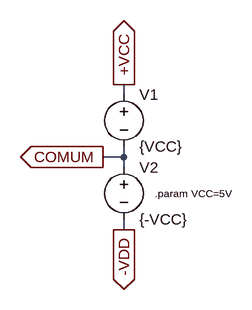
[diagram p0: schematic _SimetricSource.asc]
_SimetricSource.asc, the LTspice schematic file:
Version 4
SHEET 1 880 680
WIRE 144 64 144 48
WIRE 144 160 144 144
WIRE 144 160 112 160
WIRE 144 176 144 160
WIRE 144 272 144 256
FLAG 144 48 +VCC
IOPIN 144 48 Out
FLAG 144 272 -VDD
IOPIN 144 272 Out
FLAG 112 160 COMUM
IOPIN 112 160 Out
SYMBOL voltage 144 48 R0
SYMATTR InstName V1
SYMATTR Value {VCC}
SYMBOL voltage 144 160 R0
SYMATTR InstName V2
SYMATTR Value {-VCC}
TEXT 192 216 Left 1 !.param VCC=5V

The netlist it stands for:
* _SimetricSource.asc
V1 +VCC COMUM {VCC}
V2 COMUM -VDD {-VCC}
.param VCC=5V
.backanno
.end